# Altium schematic sheet Extension.SchDoc: Ixora
size A3; Organization: Toradex AG; Address1: Altsagenstrasse 5; Address2: Horw; Address3: 6048; Address4: Switzerland; DocumentNumber: 19; Revision: V1.1; SheetNumber: 15; SheetTotal: 17; PageSetup: Record=PageOptions|CenterHorizontal=True|CenterVertical=True|PrintScale=0.73|XCorrection=1.00|YCorrection=1.00|PrintKind=0|BorderSize=5000000|LeftOffset=0|BottomOffset=0|Orientation=2|PaperLength=1000|PaperWidth=1000|Scale=100|PaperSource=7|PrintQuality=-4|MediaType=1|DitherType=10|PaperKind=A4|PrintScaleMode=1
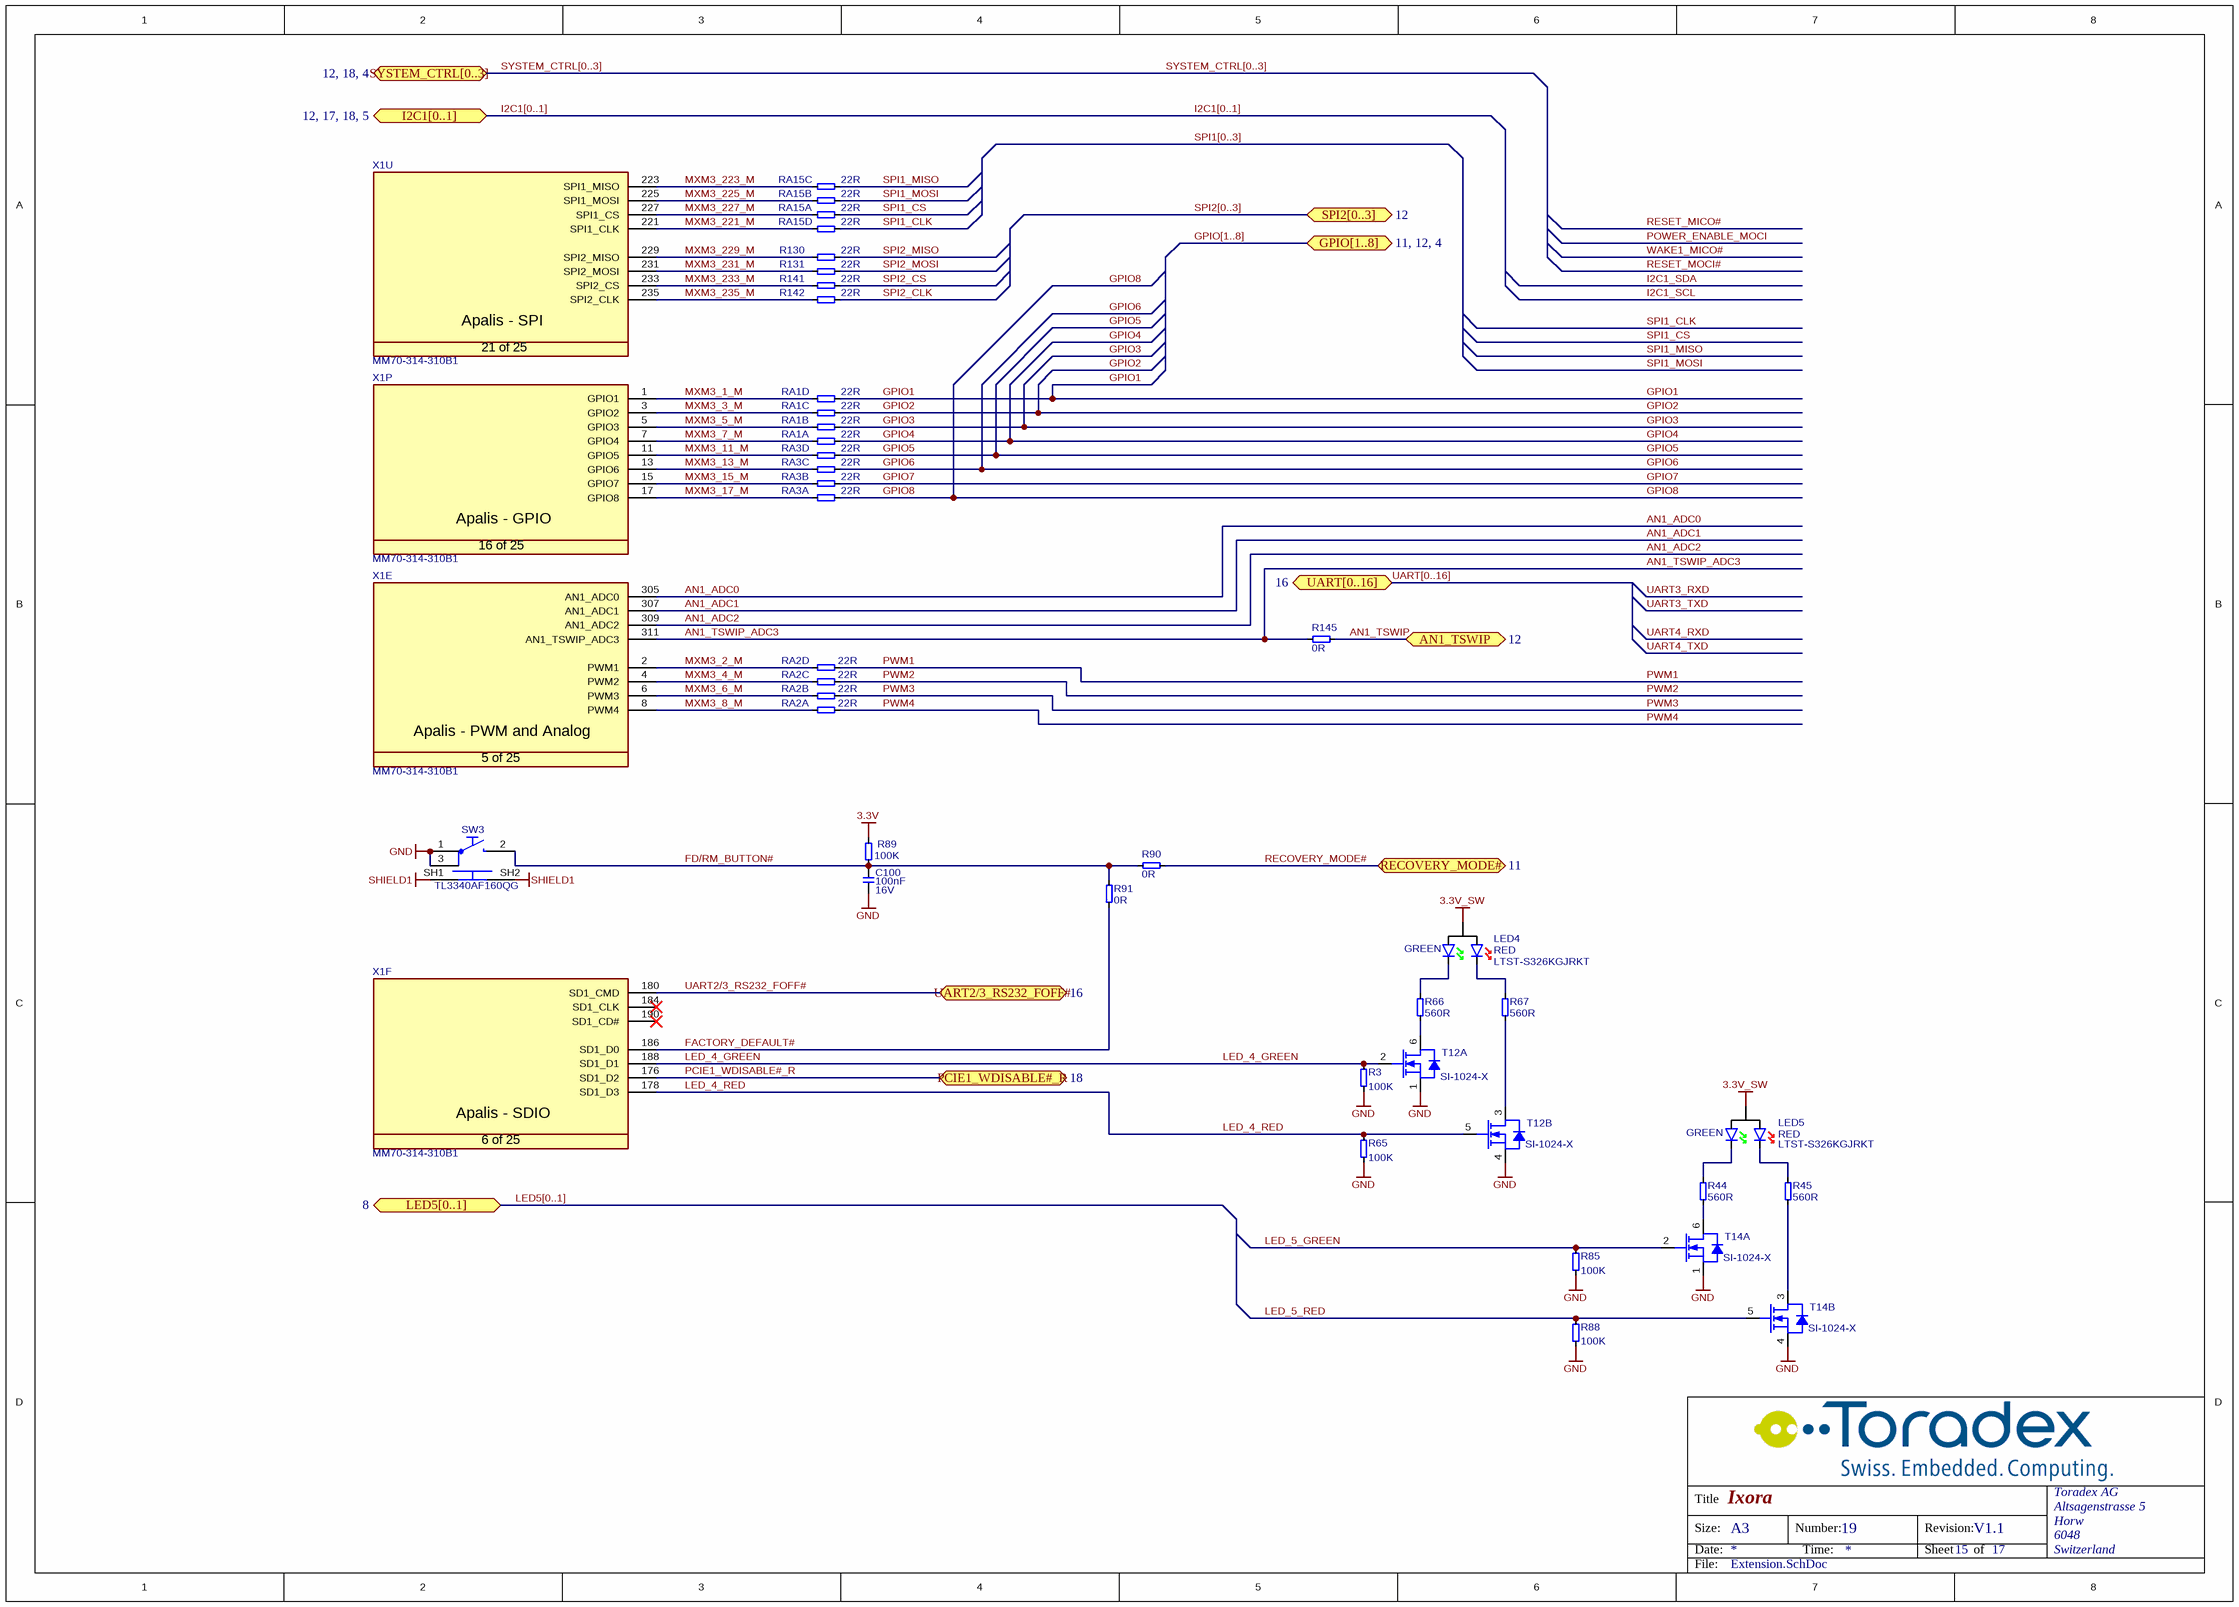
[diagram p0: Extension.SchDoc]

## Parts
C100  Rating: 16V  [CAPC1005X60N]  (hidden comment: 100nF)
LED4  Color1: GREEN  Color2: RED  [T_LiteON_LTST-S326KGJRKT]  (hidden comment: LTST-S326KGJRKT)
LED5  Color1: GREEN  Color2: RED  [T_LiteON_LTST-S326KGJRKT]  (hidden comment: LTST-S326KGJRKT)
R3  100K  [RESC1005X40N]
R44  560R  [RESC1005X40N]
R45  560R  [RESC1005X40N]
R65  100K  [RESC1005X40N]
R66  560R  [RESC1005X40N]
R67  560R  [RESC1005X40N]
R85  100K  [RESC1005X40N]
R88  100K  [RESC1005X40N]
R89  100K  [RESC1005X40N]
R90  0R  [T_RESC0603X30N]
R91  0R  [T_RESC0603X30N]
R130  22R  [RESC1005X40N]
R131  22R  [RESC1005X40N]
R141  22R  [RESC1005X40N]
R142  22R  [RESC1005X40N]
R145  0R  [RESC1005X40N]
RA1  22R  [T_Resistor_Array_X4]  (parts A,B,C,D of 4)
RA2  22R  [T_Resistor_Array_X4]  (parts A,B,C,D of 4)
RA3  22R  [T_Resistor_Array_X4]  (parts A,B,C,D of 4)
RA15  22R  [T_Resistor_Array_X4]  (parts A,B,C,D of 4)
SW3  TL3340AF160QG  [T_E-SWITCH- TL3340AF160QG]
T12  Manufacturer Part No.: SI-1024-X  [SOTFL50P160X60-6N]  (hidden comment: T-Vishay-SI-1024X-N)  (parts A,B of 2)
T14  Manufacturer Part No.: SI-1024-X  [SOTFL50P160X60-6N]  (hidden comment: T-Vishay-SI-1024X-N)  (parts A,B of 2)
X1  Manufacturer Part No.: MM70-314-310B1  [T_JAE_MM70-314-310B1]  (hidden comment: CON-JAE-MM70-314-310B1-314-0.5mm)  (parts E,F,P,U of 25)

## Ports
AN1_TSWIP (bidir, see 12), GPIO[1..8] (bidir, see 11, 12, 4), I2C1[0..1] (bidir, see 12, 17, 18, 5), LED5[0..1] (bidir, see 8), PCIE1_WDISABLE#_R (bidir, see 18), RECOVERY_MODE# (bidir, see 11), SPI2[0..3] (bidir, see 12), SYSTEM_CTRL[0..3] (bidir, see 12, 18, 4), UART2/3_RS232_FOFF# (bidir, see 16), UART[0..16] (bidir, see 16)

## Nets
3.3V: R89.1
3.3V_SW: LED4.A LED5.A
GND: C100.1 R3.2 R65.2 R85.2 R88.2 SW3.1 SW3.3 T12.1(S) T12.4(S) T14.1(S) T14.4(S)
SHIELD1: SW3.SH1 SW3.SH2
AN1_ADC0: X1.305(AN1_ADC0)
AN1_ADC1: X1.307(AN1_ADC1)
AN1_ADC2: X1.309(AN1_ADC2)
AN1_TSWIP: R145.2 ; port AN1_TSWIP
AN1_TSWIP_ADC3: R145.1 X1.311(AN1_TSWIP_ADC3)
FACTORY_DEFAULT#: R91.1 X1.186(SD1_D0)
FD/RM_BUTTON#: C100.2 R89.2 R90.1 R91.2 SW3.2
GPIO1: RA1.8
GPIO2: RA1.7
GPIO3: RA1.6
GPIO4: RA1.5
GPIO5: RA3.8
GPIO6: RA3.7
GPIO7: RA3.6
GPIO8: RA3.5
LED_4_GREEN: R3.1 T12.2(G) X1.188(SD1_D1)
LED_4_RED: R65.1 T12.5(G) X1.178(SD1_D3)
LED_5_GREEN: R85.1 T14.2(G)
LED_5_RED: R88.1 T14.5(G)
MXM3_1_M: RA1.4 X1.1(GPIO1)
MXM3_2_M: RA2.8 X1.2(PWM1)
MXM3_3_M: RA1.3 X1.3(GPIO2)
MXM3_4_M: RA2.7 X1.4(PWM2)
MXM3_5_M: RA1.2 X1.5(GPIO3)
MXM3_6_M: RA2.6 X1.6(PWM3)
MXM3_7_M: RA1.1 X1.7(GPIO4)
MXM3_8_M: RA2.5 X1.8(PWM4)
MXM3_11_M: RA3.4 X1.11(GPIO5)
MXM3_13_M: RA3.3 X1.13(GPIO6)
MXM3_15_M: RA3.2 X1.15(GPIO7)
MXM3_17_M: RA3.1 X1.17(GPIO8)
MXM3_221_M: RA15.4 X1.221(SPI1_CLK)
MXM3_223_M: RA15.3 X1.223(SPI1_MISO)
MXM3_225_M: RA15.2 X1.225(SPI1_MOSI)
MXM3_227_M: RA15.1 X1.227(SPI1_CS)
MXM3_229_M: R130.2 X1.229(SPI2_MISO)
MXM3_231_M: R131.2 X1.231(SPI2_MOSI)
MXM3_233_M: R141.2 X1.233(SPI2_CS)
MXM3_235_M: R142.2 X1.235(SPI2_CLK)
PCIE1_WDISABLE#_R: X1.176(SD1_D2) ; port PCIE1_WDISABLE#_R
PWM1: RA2.4
PWM2: RA2.3
PWM3: RA2.2
PWM4: RA2.1
RECOVERY_MODE#: R90.2 ; port RECOVERY_MODE#
SPI1_CLK: RA15.8
SPI1_CS: RA15.5
SPI1_MISO: RA15.7
SPI1_MOSI: RA15.6
SPI2_CLK: R142.1
SPI2_CS: R141.1
SPI2_MISO: R130.1
SPI2_MOSI: R131.1
UART2/3_RS232_FOFF#: X1.180(SD1_CMD) ; port UART2/3_RS232_FOFF#
NetLED4_C1: LED4.C1 R67.2
NetLED4_C2: LED4.C2 R66.2
NetLED5_C1: LED5.C1 R45.1
NetLED5_C2: LED5.C2 R44.1
NetR44_2: R44.2 T14.6(D)
NetR45_2: R45.2 T14.3(D)
NetR66_1: R66.1 T12.6(D)
NetR67_1: R67.1 T12.3(D)

Not connected (* = marked no-connect by the designer): X1 184(SD1_CLK)* 190(SD1_CD#)*

## Buses and harness runs
bus GPIO[1..8] = port GPIO[1..8]
bus I2C1[0..1] = port I2C1[0..1]
bus LED5[0..1] = port LED5[0..1]
bus SPI1[0..3]
bus SPI2[0..3] = port SPI2[0..3]
bus SYSTEM_CTRL[0..3] = port SYSTEM_CTRL[0..3]
bus UART[0..16] = port UART[0..16]

## Notes on the sheet
- Title
- Size:
- Date:
- A3
- Number:
- Time:
- Revision:
- Sheet
- of
- File:
- (in symbol CON-JAE-MM70-314-310B1-314-0.5mm, part E) Apalis - PWM and Analog; 5 of 25
- (in symbol CON-JAE-MM70-314-310B1-314-0.5mm, part F) Apalis - SDIO; 6 of 25
- (in symbol CON-JAE-MM70-314-310B1-314-0.5mm, part P) Apalis - GPIO; 16 of 25
- (in symbol CON-JAE-MM70-314-310B1-314-0.5mm, part U) Apalis - SPI; 21 of 25

## Library data of the parts
C100 = C-X7R-100nF-16V-10%-0402: Capacitor Ceramic X7R 100nF 16V 10% 0402; Tolerance: 10%; Type: X7R; Value: 100nF
LED4 LED5 = LED-LiteON-LTST-S326KGJRKT: LED Green Red LiteON LTST-S326KGJRKT; Manufacturer Name: LiteON; Manufacturer Part No.: LTST-S326KGJRKT
R3 R65 R85 R88 R89 = R-100KR-63mW-5%-0402: Resistor 100 Kohm 63mW 5% 0402; Value: 100KR; Rating: 63mW; Tolerance: 5%
R44 R45 R66 R67 = R-560R-63mW-5%-0402: Resistor 560 ohm 63mW 5% 0402; Rating: 63mW; Tolerance: 5%; Value: 560R
R90 R91 = R-0R-63mW-1%-0603: Resistor 0 ohm 63mW 1% 0603; Rating: 63mW; Tolerance: 1%; Value: 0R
R130 R131 R141 R142 = R-22R-63mW-5%-0402: Resistor 22 ohm 63mW 5% 0402; Rating: 63mW; Tolerance: 5%; Value: 22R
R145 = R-0R-63mW-1%-0402: Resistor 0 ohm 63mW 1% 0402; Rating: 63mW; Tolerance: 1%; Value: 0R
RA1-RA3 RA15 = RA-22R-63mW-5%-1206-div: Resistor Array 22 R 63mW 5% 1206; Tolerance: 5%; Power Dissipation: 63mW; Value: 22R
SW3 = SW-E-Switch-TL3340AF160QG: SWITCH TACT SUB MINI 160GF SMD Right Angle; Manufacturer Part No.: TL3340AF160QG; Manufacturer Name: E-Switch
T12 T14 = T-Vishay-SI-1024X-N: Dual N-Channel 20V (D-S)  MOSFET; Manufacturer Name: Vishay
X1 = CON-JAE-MM70-314-310B1-314-0.5mm: MXM3 Connector; Manufacturer Name: JAE; No. of ways: 314